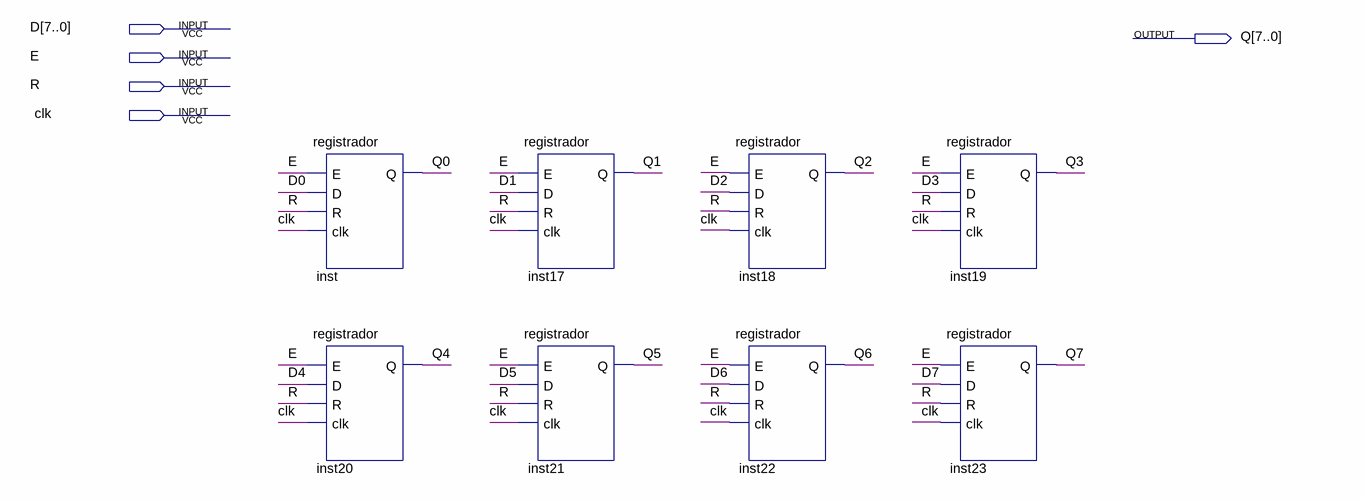
[diagram p0: schematic sheet]
// Quartus schematic REM.bdf as structural Verilog: 8 symbols, 5 pins
module REM (
  input  [7:0] D,
  input  E,
  input  R,
  input  clk,
  output [7:0] Q
);

  registrador inst (.E(E), .D(D[0]), .R(R), .clk(clk), .Q(Q[0]));
  registrador inst20 (.E(E), .D(D[4]), .R(R), .clk(clk), .Q(Q[4]));
  registrador inst17 (.E(E), .D(D[1]), .R(R), .clk(clk), .Q(Q[1]));
  registrador inst21 (.E(E), .D(D[5]), .R(R), .clk(clk), .Q(Q[5]));
  registrador inst18 (.E(E), .D(D[2]), .R(R), .clk(clk), .Q(Q[2]));
  registrador inst22 (.E(E), .D(D[6]), .R(R), .clk(clk), .Q(Q[6]));
  registrador inst19 (.E(E), .D(D[3]), .R(R), .clk(clk), .Q(Q[3]));
  registrador inst23 (.E(E), .D(D[7]), .R(R), .clk(clk), .Q(Q[7]));
endmodule
